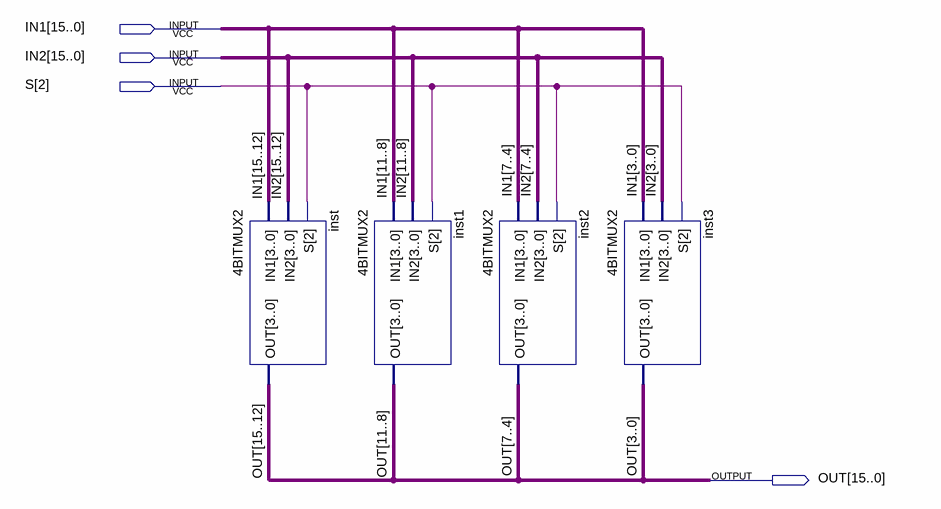
[diagram p0: schematic sheet]
// Quartus schematic 16BITMUX2.bdf as structural Verilog: 4 symbols, 4 pins
module \16BITMUX2  (
  input  [15:0] IN1,
  input  [15:0] IN2,
  input  [2:2] S,
  output [15:0] OUT
);

  \4BITMUX2  inst (.IN1(IN1[15:12]), .IN2(IN2[15:12]), .S(S[2]), .OUT(OUT[15:12]));
  \4BITMUX2  inst1 (.IN1(IN1[11:8]), .IN2(IN2[11:8]), .S(S[2]), .OUT(OUT[11:8]));
  \4BITMUX2  inst2 (.IN1(IN1[7:4]), .IN2(IN2[7:4]), .S(S[2]), .OUT(OUT[7:4]));
  \4BITMUX2  inst3 (.IN1(IN1[3:0]), .IN2(IN2[3:0]), .S(S[2]), .OUT(OUT[3:0]));
endmodule
